# Altium schematic sheet CAN1.SchDoc
size A2
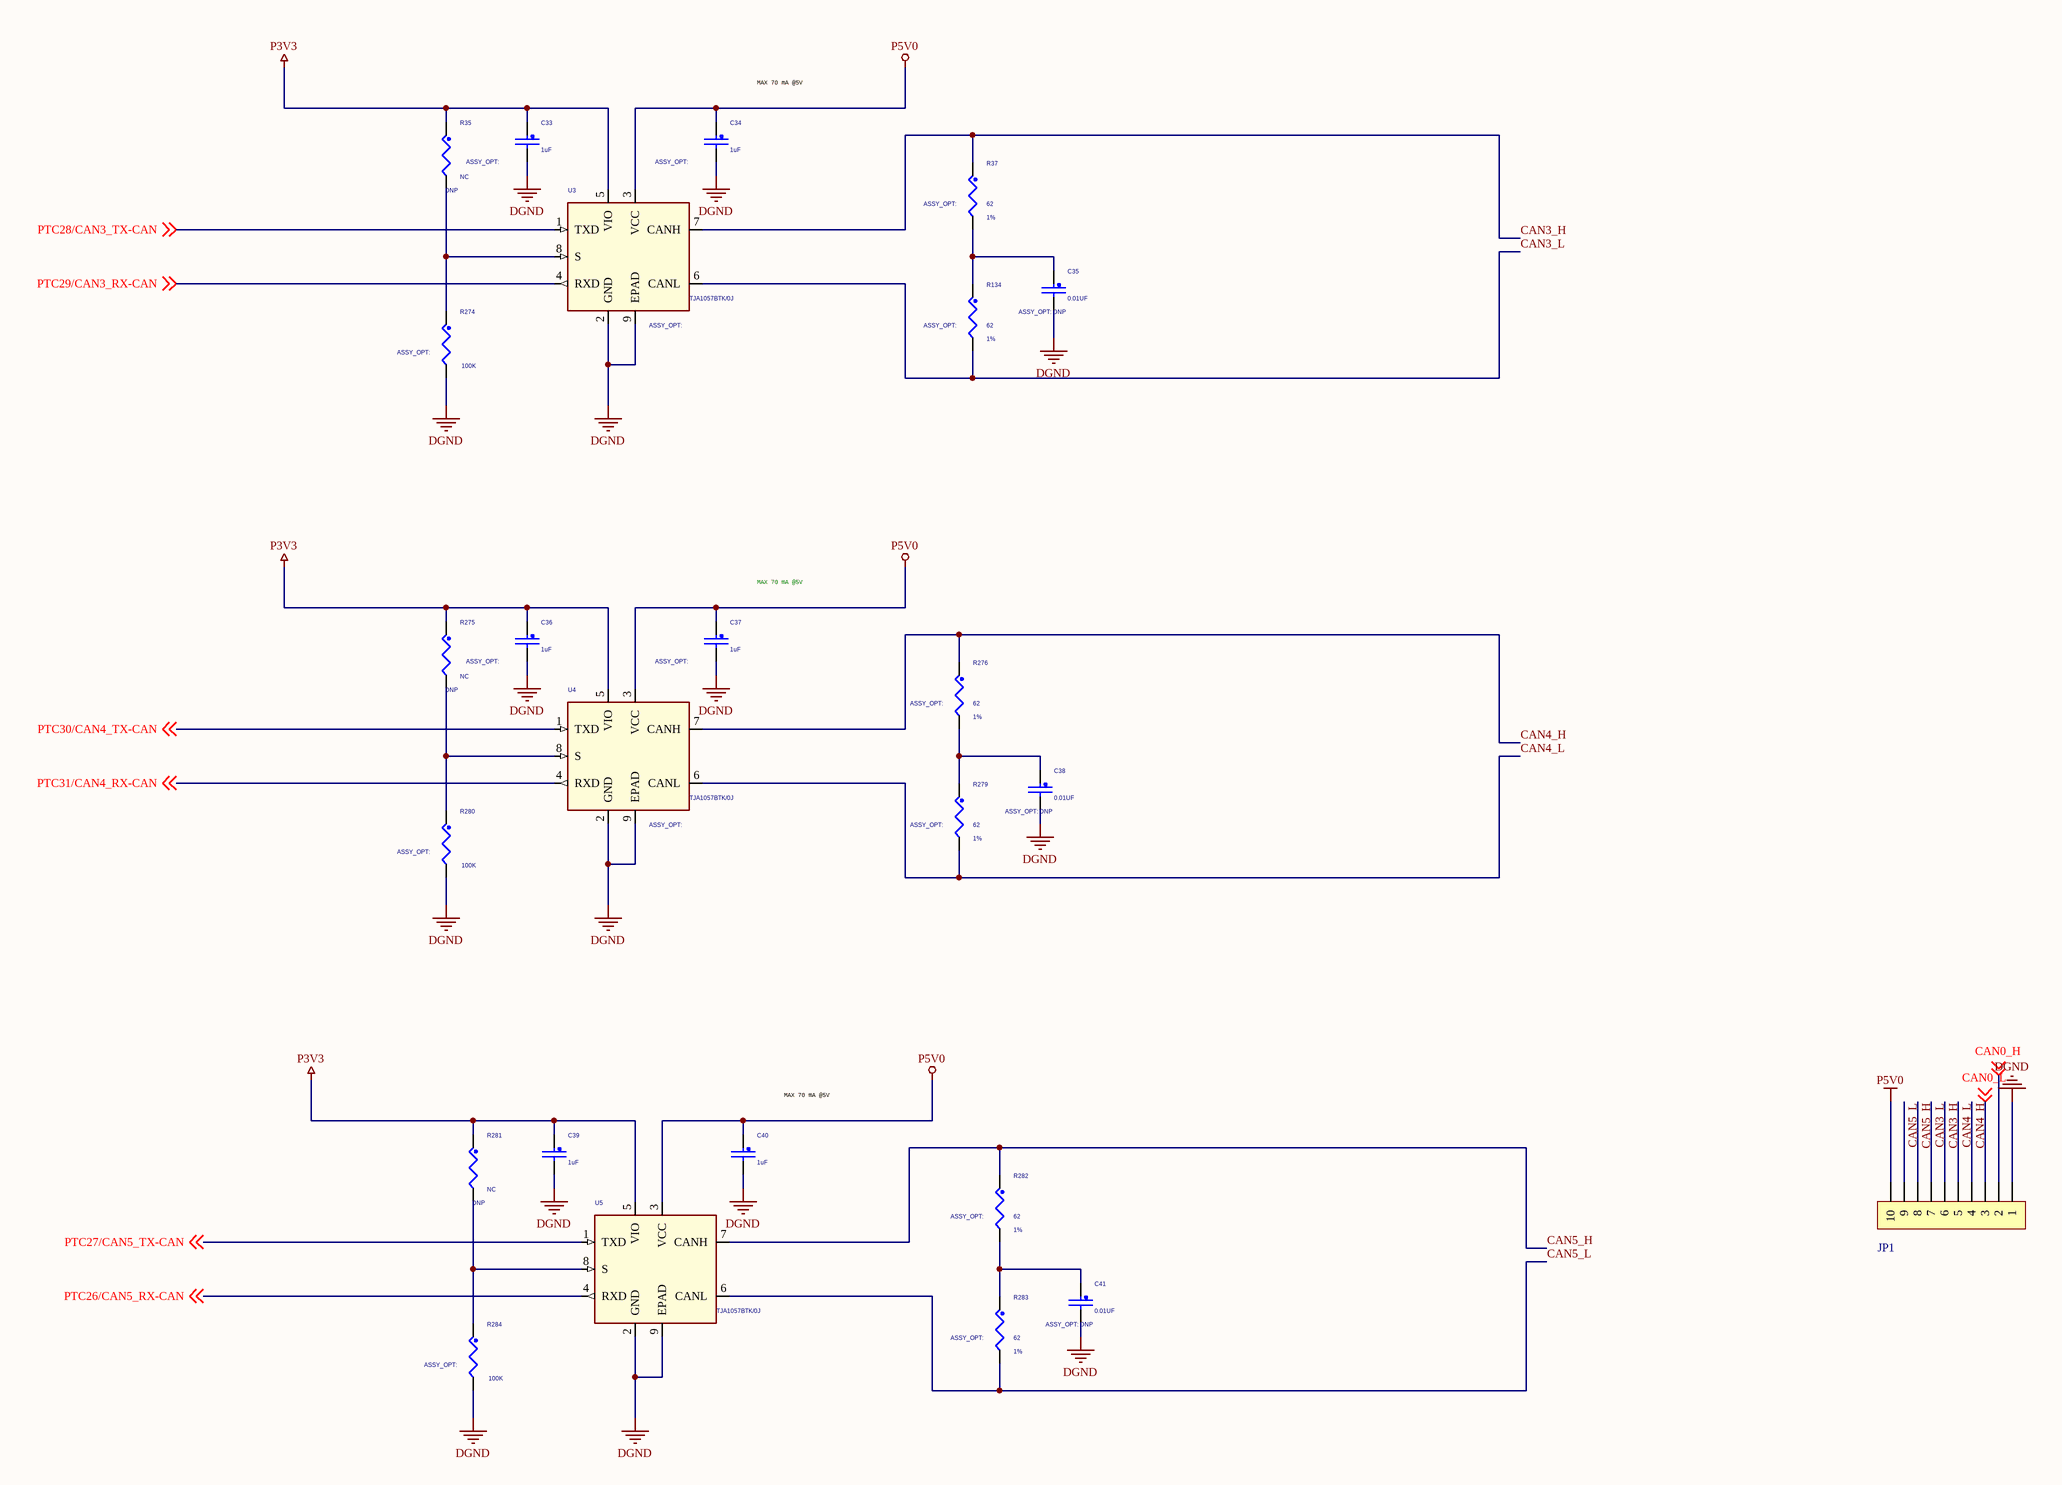
[diagram p0: CAN1.SchDoc]

## Parts
C33  1uF  [CC0402_25]
C34  1uF  [CC0402_25]
C35  0.01UF  ASSY_OPT: DNP  [CC0402_25]
C36  1uF  [CC0402_25]
C37  1uF  [CC0402_25]
C38  0.01UF  ASSY_OPT: DNP  [CC0402_25]
C39  1uF  [CC0402_25]
C40  1uF  [CC0402_25]
C41  0.01UF  ASSY_OPT: DNP  [CC0402_25]
JP1  HDR-1X10  [KF128-3.81-10P]  (value not drawn)
R35  NC  ASSY_OPT: DNP  [RC0402_25]
R37  62  Tolerance: 1%  [RC0805_OV]
R134  62  Tolerance: 1%  [RC0805_OV]
R274  100K  [RC0402_25]
R275  NC  ASSY_OPT: DNP  [RC0402_25]
R276  62  Tolerance: 1%  [RC0805_OV]
R279  62  Tolerance: 1%  [RC0805_OV]
R280  100K  [RC0402_25]
R281  NC  ASSY_OPT: DNP  [RC0402_25]
R282  62  Tolerance: 1%  [RC0805_OV]
R283  62  Tolerance: 1%  [RC0805_OV]
R284  100K  [RC0402_25]
U3  MFG_PN01: TJA1057BTK/0J  [son8_0p65_3p15x3p15]  (hidden comment: TJA1057BTK)
U4  MFG_PN01: TJA1057BTK/0J  [son8_0p65_3p15x3p15]  (hidden comment: TJA1057BTK)
U5  MFG_PN01: TJA1057BTK/0J  [son8_0p65_3p15x3p15]  (hidden comment: TJA1057BTK)

## Nets
DGND: C33.2 C34.2 C35.2 C36.2 C37.2 C38.2 C39.2 C40.2 C41.2 JP1.1 R274.2 R280.2 R284.2 U3.2(GND) U3.9(EPAD) U4.2(GND) U4.9(EPAD) U5.2(GND) U5.9(EPAD)
P3V3: C33.1 C36.1 C39.1 R35.1 R275.1 R281.1 U3.5(VIO) U4.5(VIO) U5.5(VIO)
P5V0: C34.1 C37.1 C40.1 JP1.10 U3.3(VCC) U4.3(VCC) U5.3(VCC)
CAN0_H: JP1.2 ; off-sheet CAN0_H
CAN0_L: JP1.3 ; off-sheet CAN0_L
CAN3_H: JP1.6 R37.1 U3.7(CANH)
CAN3_L: JP1.7 R134.2 U3.6(CANL)
CAN4_H: JP1.4 R276.1 U4.7(CANH)
CAN4_L: JP1.5 R279.2 U4.6(CANL)
CAN5_H: JP1.8 R282.1 U5.7(CANH)
CAN5_L: JP1.9 R283.2 U5.6(CANL)
PTC26/CAN5_RX-CAN: U5.4(RXD) ; off-sheet PTC26/CAN5_RX-CAN
PTC27/CAN5_TX-CAN: U5.1(TXD) ; off-sheet PTC27/CAN5_TX-CAN
PTC28/CAN3_TX-CAN: U3.1(TXD) ; off-sheet PTC28/CAN3_TX-CAN
PTC29/CAN3_RX-CAN: U3.4(RXD) ; off-sheet PTC29/CAN3_RX-CAN
PTC30/CAN4_TX-CAN: U4.1(TXD) ; off-sheet PTC30/CAN4_TX-CAN
PTC31/CAN4_RX-CAN: U4.4(RXD) ; off-sheet PTC31/CAN4_RX-CAN
NetC35_1: C35.1 R37.2 R134.1
NetC38_1: C38.1 R276.2 R279.1
NetC41_1: C41.1 R282.2 R283.1
NetR35_2: R35.2 R274.1 U3.8(S)
NetR275_2: R275.2 R280.1 U4.8(S)
NetR281_2: R281.2 R284.1 U5.8(S)

## Notes on the sheet
- MAX 70 mA @5V

## Library data of the parts
C33 C34 C39 = CAP_NP: CAP CER 1.0uF 16V 10% X6S 0402; CLASS: DISCRETE; Temp Range: -55C to +105C; FPLIST: CC0402_25,CC0402_HD,0402_CC,capc0402_l; CAD_APPROVED: Yes; MFG_PN01: GRM155C81C105KE11D; MFG_NAME01: MURATA; AGILE_PN: 150-80262; SIGNAL_MODEL: DEFAULT_CAPACITOR_1e+06pF_2_1; Temp_Range: -55癈 to +125癈; Rated Voltage: 16V; VOLTAGE: 16V; HEIGHT: 0.55; ROHS: Yes; Tolerance: 10%
C35 = CAP_NP: CAP CER 0.01UF 50V 10% X7R 0402; CLASS: DISCRETE; AGILE_PN: 150-30114; FPLIST: CC0402_25,CC0402_HD,0402_CC,capc0402_l; CAD_APPROVED: Yes; Temp Range: -55C to +125C; MFG_NAME01: MURATA; MFG_PN01: GRM155R71H103KA88D; HEIGHT: 0.55MM; Tolerance: 10%; Rated Voltage: 50V; ROHS: NULL
C36 C37 C40 = CAP_NP: CAP CER 1.0uF 16V 10% X6S 0402; CLASS: DISCRETE; Temp_Range: -55癈 to +125癈; SIGNAL_MODEL: DEFAULT_CAPACITOR_1e+06pF_2_1; AGILE_PN: 150-80262; MFG_NAME01: MURATA; MFG_PN01: GRM155C81C105KE11D; CAD_APPROVED: Yes; FPLIST: CC0402_25,CC0402_HD,0402_CC,capc0402_l; Temp Range: -55C to +105C; Tolerance: 10%; ROHS: Yes; HEIGHT: 0.55; VOLTAGE: 16V; Rated Voltage: 16V
C38 C41 = CAP_NP: CAP CER 0.01UF 50V 10% X7R 0402; CLASS: DISCRETE; MFG_PN01: GRM155R71H103KA88D; MFG_NAME01: MURATA; Temp Range: -55C to +125C; CAD_APPROVED: Yes; FPLIST: CC0402_25,CC0402_HD,0402_CC,capc0402_l; AGILE_PN: 150-30114; ROHS: NULL; Rated Voltage: 50V; Tolerance: 10%; HEIGHT: 0.55MM
JP1 = Header 10: 10P接插件; BOM名称: 10P接插件
R35 R281 = RES: RES MF 10K 1/16W 5% 0402; CLASS: DISCRETE; FPLIST: RC0402_25,RC0402_HD,0402_CC; CAD_APPROVED: Yes; MFG_PN01: CR0402-JW-103GLF; MFG_NAME01: BOURNS; AGILE_PN: 470-75557; SIGNAL_MODEL: DEFAULT_RESISTOR_10000OHM_2_1; Temp_Range: ?5 癈 to +155 癈; HEIGHT: 0.4MM; TOL: 5%; ROHS: NULL; Tolerance: 5%
R37 R276 R279 = RES: RES MF 62 OHM 1/4W 1% AEC-Q200 0805; CLASS: DISCRETE; MFG_PN01: SG73P2ATTD62R0F; MFG_NAME01: KOA SPEER; Temp Range: -55 °C to +155 °C; CAD_APPROVED: Yes; FPLIST: RC0805_OV,RC0805,0805_CC; AGILE_PN: 470-83214; 3D_Mechanical_Footprint_File: http://fcl.am.freescale.net/ALLEGRO/step/RC0805_OV.STEP; ROHS: Yes; HEIGHT: 0.60; Package Size: 0805 (2012 Metric)
R134 R282 R283 = RES: RES MF 62 OHM 1/4W 1% AEC-Q200 0805; CLASS: DISCRETE; AGILE_PN: 470-83214; FPLIST: RC0805_OV,RC0805,0805_CC; CAD_APPROVED: Yes; Temp Range: -55 °C to +155 °C; MFG_NAME01: KOA SPEER; MFG_PN01: SG73P2ATTD62R0F; Package Size: 0805 (2012 Metric); HEIGHT: 0.60; ROHS: Yes; 3D_Mechanical_Footprint_File: http://fcl.am.freescale.net/ALLEGRO/step/RC0805_OV.STEP
R274 R284 = RES: RES MF 100K 1/16W 1% 0402; CLASS: DISCRETE; MFG_PN01: CRCW0402100KFKEDC; MFG_NAME01: VISHAY INTERTECHNOLOGY; CAD_APPROVED: Yes; FPLIST: RC0402_25,RC0402_HD,0402_CC; AGILE_PN: 470-76240; ROHS: Yes; Tolerance: 1%; HEIGHT: 0.4
R275 = RES: RES MF 10K 1/16W 5% 0402; CLASS: DISCRETE; Temp_Range: ?5 癈 to +155 癈; SIGNAL_MODEL: DEFAULT_RESISTOR_10000OHM_2_1; AGILE_PN: 470-75557; MFG_NAME01: BOURNS; MFG_PN01: CR0402-JW-103GLF; CAD_APPROVED: Yes; FPLIST: RC0402_25,RC0402_HD,0402_CC; Tolerance: 5%; ROHS: NULL; TOL: 5%; HEIGHT: 0.4MM
R280 = RES: RES MF 100K 1/16W 1% 0402; CLASS: DISCRETE; AGILE_PN: 470-76240; FPLIST: RC0402_25,RC0402_HD,0402_CC; CAD_APPROVED: Yes; MFG_NAME01: VISHAY INTERTECHNOLOGY; MFG_PN01: CRCW0402100KFKEDC; HEIGHT: 0.4; Tolerance: 1%; ROHS: Yes
U3 U4 = TJA1051TK_3_HVSON8: IC XCVR CAN 4.5-5.5V AEC-Q100 HVSON8; MFG_NAME01: NXP Semiconductor; CAD_APPROVED: Yes; Supply Voltage: 4.5 V to 5.5 V; AGILE_PN: 312-10381; CLASS: IC; 3D_Mechanical_Footprint_File: http://fcl.am.freescale.net/ALLEGRO/step/son8_0p65_3p15x3p15.STEP; ROHS: NULL; HEIGHT: 1mm; Package Size: HVSON-8
U5 = TJA1051TK_3_HVSON8: IC XCVR CAN 4.5-5.5V AEC-Q100 HVSON8; AGILE_PN: 312-10381; Supply Voltage: 4.5 V to 5.5 V; CAD_APPROVED: Yes; MFG_NAME01: NXP Semiconductor; CLASS: IC; Package Size: HVSON-8; HEIGHT: 1mm; ROHS: NULL; 3D_Mechanical_Footprint_File: http://fcl.am.freescale.net/ALLEGRO/step/son8_0p65_3p15x3p15.STEP